# Altium project HVAMP_8CH.PrjPCB (part 1 of 3)
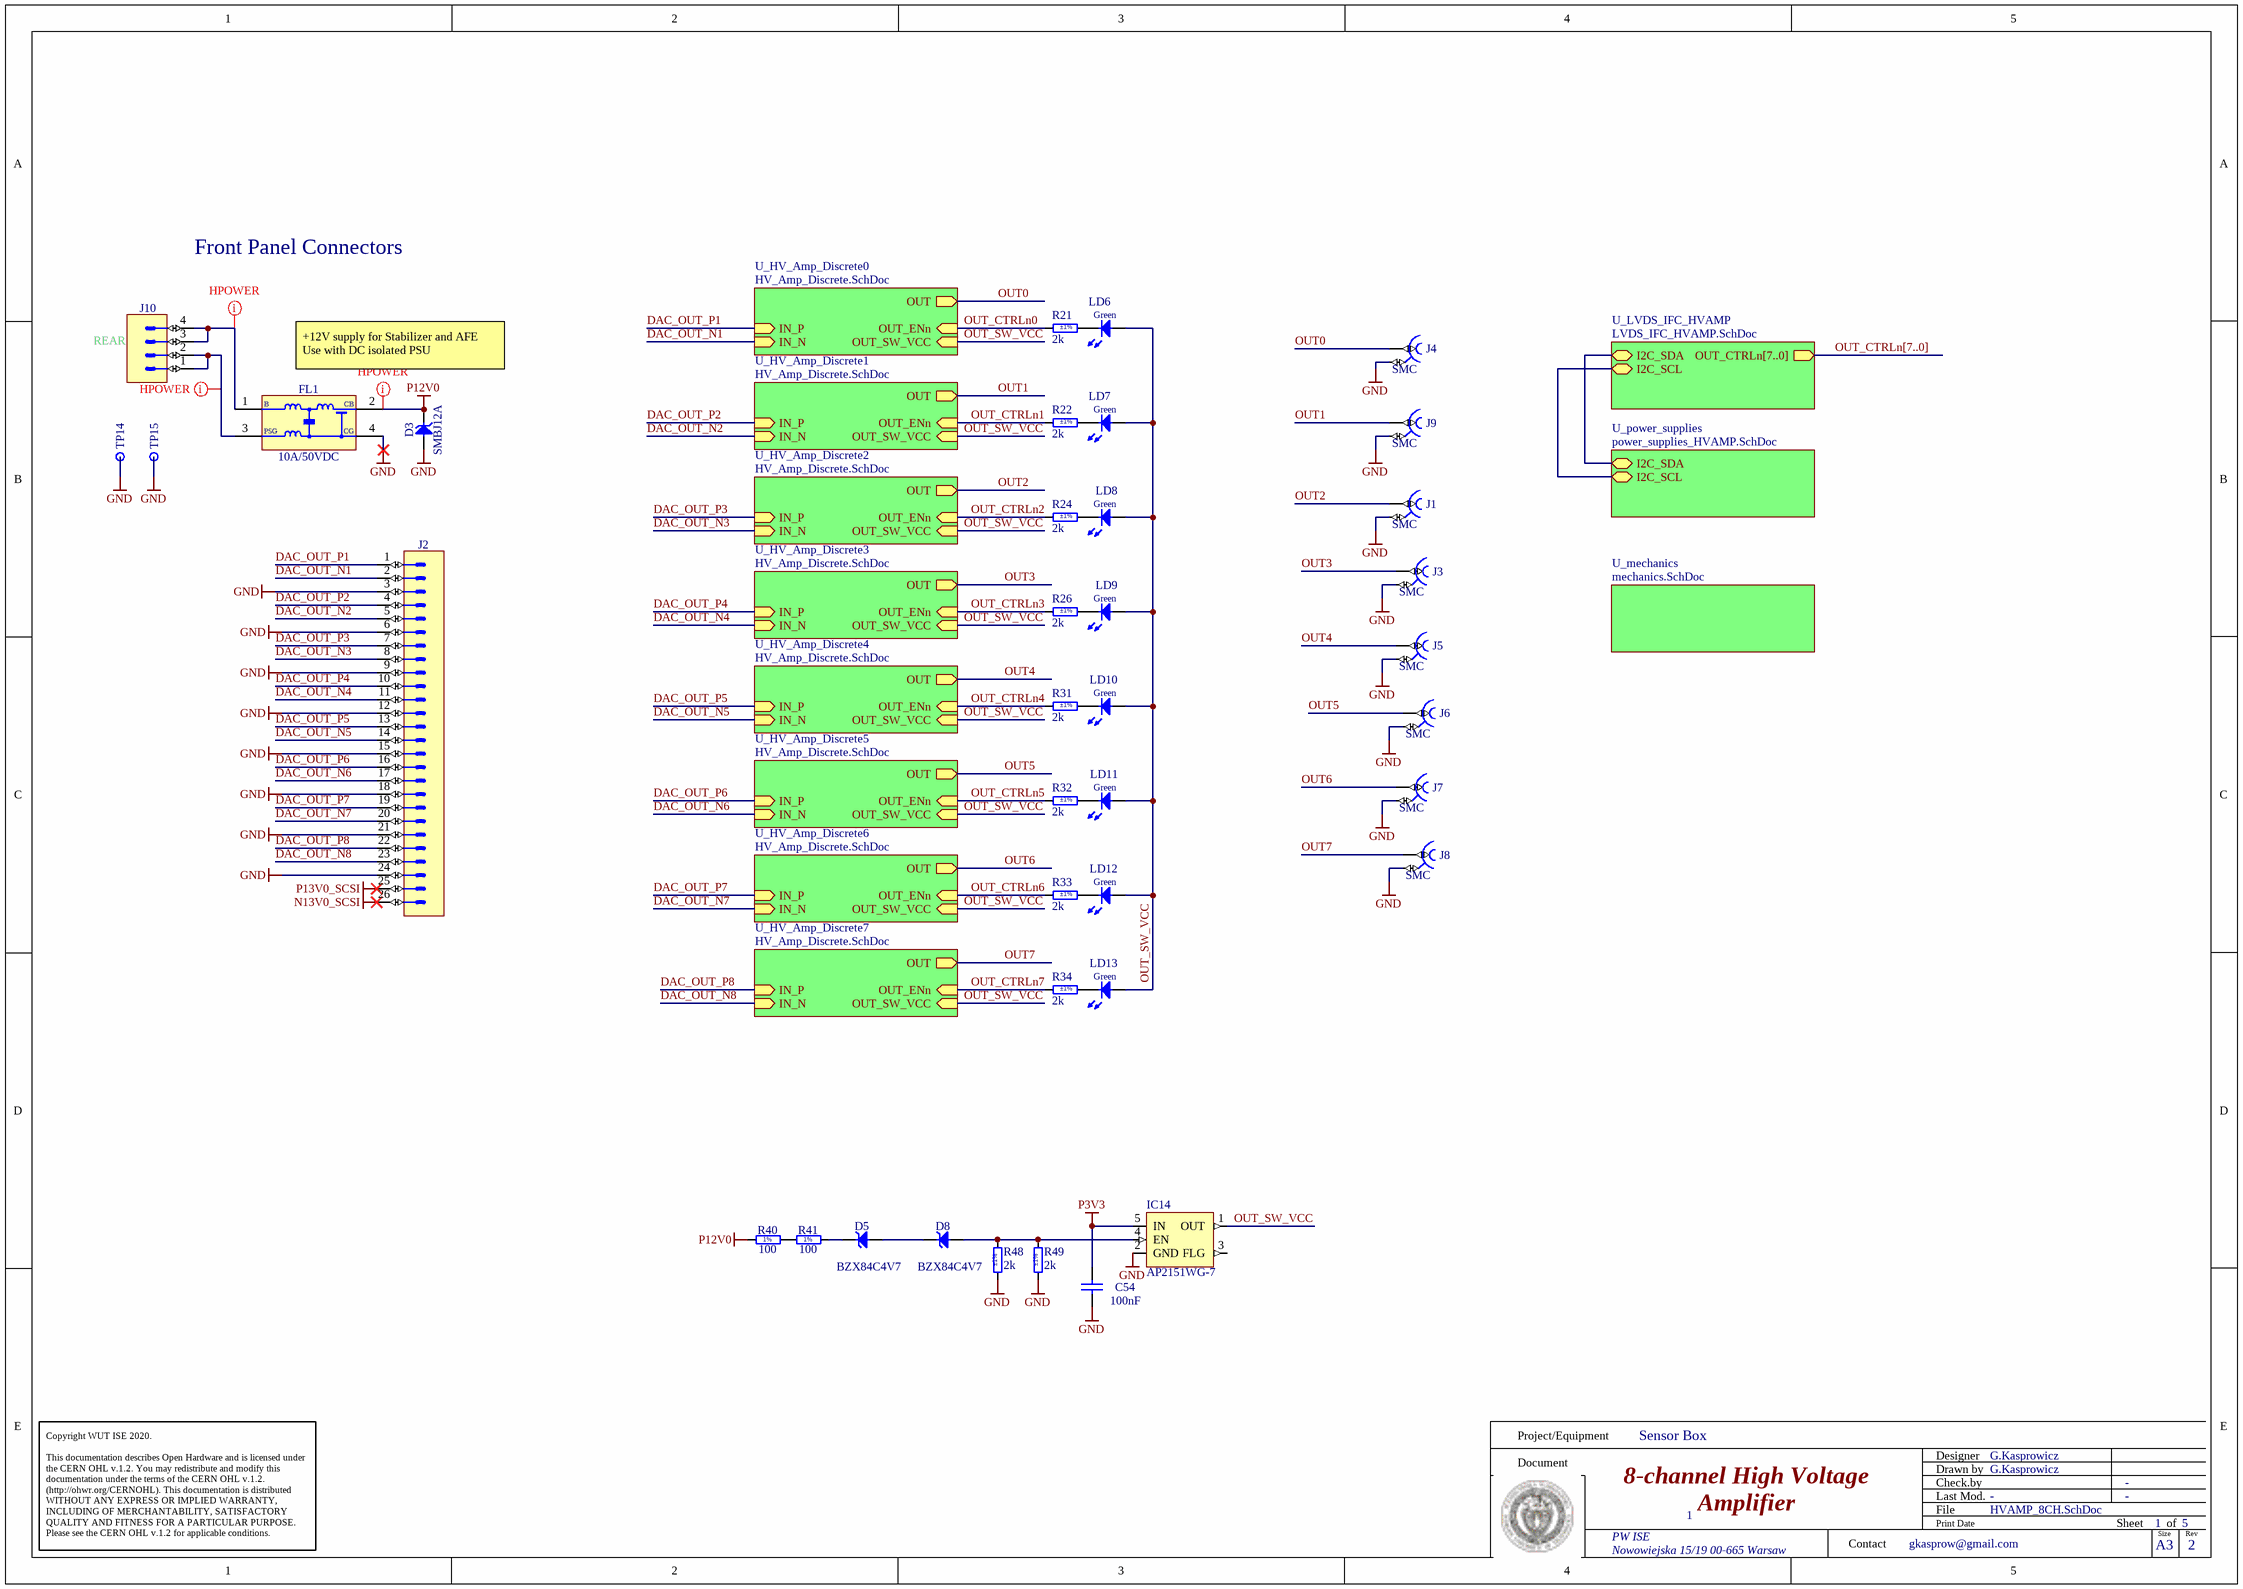
[diagram p0: HVAMP_8CH.SchDoc]
ProjRevision: 1.2; ProjOrganization: Institute of Electronic systems; ProjAddress3: Warsaw, Poland; ProjAddress2: Nowowiejska 15/19; ProjAddress1: Warsaw University of Technology
5 sheets, 364 parts. Net scope: hierarchical (ports join the sheet entries above them; power ports are global).
Board files: HVAMP_8CH.PcbDoc, Panel_HVAMP_8CH.PcbDoc
Sheets:
  HVAMP_8CH.SchDoc
    U_power_supplies = power_supplies_HVAMP.SchDoc
    U_mechanics = mechanics.SchDoc
    U_LVDS_IFC_HVAMP = LVDS_IFC_HVAMP.SchDoc
    U_HV_Amp_Discrete0 = HV_Amp_Discrete.SchDoc
    U_HV_Amp_Discrete1 = HV_Amp_Discrete.SchDoc
    U_HV_Amp_Discrete2 = HV_Amp_Discrete.SchDoc
    U_HV_Amp_Discrete3 = HV_Amp_Discrete.SchDoc
    U_HV_Amp_Discrete4 = HV_Amp_Discrete.SchDoc
    U_HV_Amp_Discrete5 = HV_Amp_Discrete.SchDoc
    U_HV_Amp_Discrete6 = HV_Amp_Discrete.SchDoc
    U_HV_Amp_Discrete7 = HV_Amp_Discrete.SchDoc

## Sheet HVAMP_8CH.SchDoc: 8-channel High Voltage
size 420 x 297 mm; Author: G.Kasprowicz; CompanyName: WUT ISE; DrawnBy: G.Kasprowicz; Organization: WUT ISE; Address1: PW ISE; Address2: Nowowiejska 15/19 00-665 Warsaw; Address3: gkasprow@gmail.com; DocumentNumber: 1; Revision: 2; SheetNumber: 1; SheetTotal: 5; ModifiedBy: -; CheckedDate: -; Title2: Amplifier; DivGrp: WUT ISE; Designer: G.Kasprowicz; ModifiedDate: -; ProjectName: Sensor Box

### Parts
C54  100nF  [CAPC1005X55N]
D3  SMBJ12A  [DIOM5336X265N]
D5  BZX84C4V7  [SOT95P240X130-3N]
D8  BZX84C4V7  [SOT95P240X130-3N]
FL1  10A/50VDC  [FIL_MURATA_BNX02]
IC14  AP2151WG-7  [SOT23-5]
J1  SMC  [JOHNSON_131-6701-341]
J2  Header 26  [3M_N2526-6002RB]  (value not drawn)
J3  SMC  [JOHNSON_131-6701-341]
J4  SMC  [JOHNSON_131-6701-341]
J5  SMC  [JOHNSON_131-6701-341]
J6  SMC  [JOHNSON_131-6701-341]
J7  SMC  [JOHNSON_131-6701-341]
J8  SMC  [JOHNSON_131-6701-341]
J9  SMC  [JOHNSON_131-6701-341]
J10  Mini-Fit Jr.™  [MOLEX_39-30-0040]  (value not drawn)
LD6  Green  [LED_AVAGO_HSME-C120]
LD7  Green  [LED_AVAGO_HSME-C120]
LD8  Green  [LED_AVAGO_HSME-C120]
LD9  Green  [LED_AVAGO_HSME-C120]
LD10  Green  [LED_AVAGO_HSME-C120]
LD11  Green  [LED_AVAGO_HSME-C120]
LD12  Green  [LED_AVAGO_HSME-C120]
LD13  Green  [LED_AVAGO_HSME-C120]
R21  2k  Tolerance: ±1%  [RESC1005X40N]
R22  2k  Tolerance: ±1%  [RESC1005X40N]
R24  2k  Tolerance: ±1%  [RESC1005X40N]
R26  2k  Tolerance: ±1%  [RESC1005X40N]
R31  2k  Tolerance: ±1%  [RESC1005X40N]
R32  2k  Tolerance: ±1%  [RESC1005X40N]
R33  2k  Tolerance: ±1%  [RESC1005X40N]
R34  2k  Tolerance: ±1%  [RESC1005X40N]
R40  100  [RESC1005X40N]
R41  100  [RESC1005X40N]
R48  2k  Tolerance: ±1%  [RESC1005X40N]
R49  2k  Tolerance: ±1%  [RESC1005X40N]
TP14  Test Point  [TPS127]  (value not drawn)
TP15  Test Point  [TPS127]  (value not drawn)

### Sub-sheets
U_HV_Amp_Discrete0 = HV_Amp_Discrete.SchDoc: OUT (out), IN_P (in), IN_N (in), OUT_ENn (in), OUT_SW_VCC (in)
U_HV_Amp_Discrete1 = HV_Amp_Discrete.SchDoc: OUT (out), IN_P (in), IN_N (in), OUT_ENn (in), OUT_SW_VCC (in)
U_HV_Amp_Discrete2 = HV_Amp_Discrete.SchDoc: OUT (out), IN_P (in), IN_N (in), OUT_ENn (in), OUT_SW_VCC (in)
U_HV_Amp_Discrete3 = HV_Amp_Discrete.SchDoc: OUT (out), IN_P (in), IN_N (in), OUT_ENn (in), OUT_SW_VCC (in)
U_HV_Amp_Discrete4 = HV_Amp_Discrete.SchDoc: OUT (out), IN_P (in), IN_N (in), OUT_ENn (in), OUT_SW_VCC (in)
U_HV_Amp_Discrete5 = HV_Amp_Discrete.SchDoc: OUT (out), IN_P (in), IN_N (in), OUT_ENn (in), OUT_SW_VCC (in)
U_HV_Amp_Discrete6 = HV_Amp_Discrete.SchDoc: OUT (out), IN_P (in), IN_N (in), OUT_ENn (in), OUT_SW_VCC (in)
U_HV_Amp_Discrete7 = HV_Amp_Discrete.SchDoc: OUT (out), IN_P (in), IN_N (in), OUT_ENn (in), OUT_SW_VCC (in)
U_LVDS_IFC_HVAMP = LVDS_IFC_HVAMP.SchDoc: I2C_SDA (bidir), I2C_SCL (bidir), OUT_CTRLn[7..0] (out)
U_mechanics = mechanics.SchDoc: no entries
U_power_supplies = power_supplies_HVAMP.SchDoc: I2C_SDA (bidir), I2C_SCL (bidir)

### Nets
GND: C54.1 D3.2(A) FL1.4(CG) IC14.2(GND) J1.2 J2.3 J2.6 J2.9 J2.12 J2.15 J2.18 J2.21 J2.24 J3.2 J4.2 J5.2 J6.2 J7.2 J8.2 J9.2 R48.2 R49.2 TP14.1 TP15.1
N13V0_SCSI: J2.26
P3V3: C54.2 IC14.5(IN)
P12V0: D3.1(C) FL1.2(CB) R40.1
P13V0_SCSI: J2.25
DAC_OUT_N1: J2.2 ; sheet U_HV_Amp_Discrete0/IN_N
DAC_OUT_N2: J2.5 ; sheet U_HV_Amp_Discrete1/IN_N
DAC_OUT_N3: J2.8 ; sheet U_HV_Amp_Discrete2/IN_N
DAC_OUT_N4: J2.11 ; sheet U_HV_Amp_Discrete3/IN_N
DAC_OUT_N5: J2.14 ; sheet U_HV_Amp_Discrete4/IN_N
DAC_OUT_N6: J2.17 ; sheet U_HV_Amp_Discrete5/IN_N
DAC_OUT_N7: J2.20 ; sheet U_HV_Amp_Discrete6/IN_N
DAC_OUT_N8: J2.23 ; sheet U_HV_Amp_Discrete7/IN_N
DAC_OUT_P1: J2.1 ; sheet U_HV_Amp_Discrete0/IN_P
DAC_OUT_P2: J2.4 ; sheet U_HV_Amp_Discrete1/IN_P
DAC_OUT_P3: J2.7 ; sheet U_HV_Amp_Discrete2/IN_P
DAC_OUT_P4: J2.10 ; sheet U_HV_Amp_Discrete3/IN_P
DAC_OUT_P5: J2.13 ; sheet U_HV_Amp_Discrete4/IN_P
DAC_OUT_P6: J2.16 ; sheet U_HV_Amp_Discrete5/IN_P
DAC_OUT_P7: J2.19 ; sheet U_HV_Amp_Discrete6/IN_P
DAC_OUT_P8: J2.22 ; sheet U_HV_Amp_Discrete7/IN_P
I2C_SCL: sheet U_power_supplies/I2C_SCL, sheet U_LVDS_IFC_HVAMP/I2C_SCL
I2C_SDA: sheet U_power_supplies/I2C_SDA, sheet U_LVDS_IFC_HVAMP/I2C_SDA
OUT0: J4.1 ; sheet U_HV_Amp_Discrete0/OUT
OUT1: J9.1 ; sheet U_HV_Amp_Discrete1/OUT
OUT2: J1.1 ; sheet U_HV_Amp_Discrete2/OUT
OUT3: J3.1 ; sheet U_HV_Amp_Discrete3/OUT
OUT4: J5.1 ; sheet U_HV_Amp_Discrete4/OUT
OUT5: J6.1 ; sheet U_HV_Amp_Discrete5/OUT
OUT6: J7.1 ; sheet U_HV_Amp_Discrete6/OUT
OUT7: J8.1 ; sheet U_HV_Amp_Discrete7/OUT
OUT_CTRLn0: R21.2 ; sheet U_HV_Amp_Discrete0/OUT_ENn
OUT_CTRLn1: R22.2 ; sheet U_HV_Amp_Discrete1/OUT_ENn
OUT_CTRLn2: R24.2 ; sheet U_HV_Amp_Discrete2/OUT_ENn
OUT_CTRLn3: R26.2 ; sheet U_HV_Amp_Discrete3/OUT_ENn
OUT_CTRLn4: R31.2 ; sheet U_HV_Amp_Discrete4/OUT_ENn
OUT_CTRLn5: R32.2 ; sheet U_HV_Amp_Discrete5/OUT_ENn
OUT_CTRLn6: R33.2 ; sheet U_HV_Amp_Discrete6/OUT_ENn
OUT_CTRLn7: R34.2 ; sheet U_HV_Amp_Discrete7/OUT_ENn
OUT_SW_VCC: IC14.1(OUT) LD6.2(A) LD7.2(A) LD8.2(A) LD9.2(A) LD10.2(A) LD11.2(A) LD12.2(A) LD13.2(A) ; sheet U_HV_Amp_Discrete0/OUT_SW_VCC, sheet U_HV_Amp_Discrete1/OUT_SW_VCC, sheet U_HV_Amp_Discrete2/OUT_SW_VCC, sheet U_HV_Amp_Discrete3/OUT_SW_VCC, sheet U_HV_Amp_Discrete4/OUT_SW_VCC, sheet U_HV_Amp_Discrete5/OUT_SW_VCC, sheet U_HV_Amp_Discrete6/OUT_SW_VCC, sheet U_HV_Amp_Discrete7/OUT_SW_VCC
NetD5_1: D5.1(A) D8.3(C)
NetD5_3: D5.3(C) R41.2
NetD8_1: D8.1(A) IC14.4(EN) R48.1 R49.1
NetFL1_1: FL1.1(B) J10.3 J10.4
NetFL1_3: FL1.3(PSG) J10.1 J10.2
NetLD6_1: LD6.1(C) R21.1
NetLD7_1: LD7.1(C) R22.1
NetLD8_1: LD8.1(C) R24.1
NetLD9_1: LD9.1(C) R26.1
NetLD10_1: LD10.1(C) R31.1
NetLD11_1: LD11.1(C) R32.1
NetLD12_1: LD12.1(C) R33.1
NetLD13_1: LD13.1(C) R34.1
NetR40_2: R40.2 R41.1

Not connected (* = marked no-connect by the designer): IC14 3(FLG)

### Buses and harness runs
bus OUT_CTRLn[7..0] = sheet U_LVDS_IFC_HVAMP/OUT_CTRLn[7..0]

### Layout directives
net class Hpower: NetFL1_1, NetFL1_3, P12V0

### Notes on the sheet
- Front Panel Connectors
- (near J10) REAR
- +12V supply for Stabilizer and AFE
  Use with DC isolated PSU
- Project/Equipment
- Document
- Designer
- Drawn by
- Check.by
- Copyright WUT ISE 2020.
  This documentation describes Open Hardware and is licensed under the CERN OHL v.1.2. You may redistribute and modify this documentation under the terms of the CERN OHL v.1.2. (http://ohwr.org/CERNOHL). This documentation is distributed WITHOUT ANY EXPRESS OR IMPLIED WARRANTY, INCLUDING OF MERCHANTABILITY, SATISFACTORY QUALITY AND FITNESS FOR A PARTICULAR PURPOSE. Please see the CERN OHL v.1.2 for applicable conditions.
- Contact
- File
- Last Mod.
- Print Date
- Sheet
- Size
- A3
- of
- Rev
- (in symbol R0402_100R_1%_0.0625W_100PPM) 1%

### Library data of the parts
C54 = CC0402_100NF_16V_10%_X5R: Non-polarised capacitor; Part Description: SMD Multilayer Chip Ceramic Capacitor; Manufacturer: GENERIC; Manufacturer1 Part Number: GRM155R61C104KA88D; Voltage: 16V; TC: X5R; Tolerance: ±10%; Part Number: CC0402_100NF_16V_10%_X5R; Component Kind: Standard; Component Type: Standard; Pin Count: 2; Value: 100nF; Status: None; Manufacturer Part Number: CC0402_100NF_16V_10%_X5R; Case: 0402; Mounted: Yes; Socket: No; SMD: Yes; Sense: No; Manufacturer1 Example: MURATA; Manufacturer1 ComponentHeight: 0.55mm; HelpURL: \\cern.ch\dfs\Applications\Altium\Datasheets\CC0402_X5R_MURATA_GRM.pdf; Author: CERN DEM JLC; CreateDate: 10.12.2013; LatestRevisionDate: 10.12.2013
D3 = SMBJ12A: Zener Diode; Part Description: Uni-Directional Transient Voltage Suppressor Diode; Manufacturer: FAIRCHILD SEMICONDUCTOR; Voltage: 12V; Power: 600W; PressFit: No; Bonding: No; Part Number: SMBJ12A; Component Kind: Standard; Component Type: Standard; Device: SMBJ12A; PackageDescription: DO-214-AA/SMB Diode, Molded Body; 5.34mm L X 3.625mm W X 2.65mm H, IPC Medium Density; Manufacturer Part Number: SMBJ12A; Pin Count: 2; Case: DO-214AA; Mounted: Yes; Socket: No; SMD: Yes; Sense: No; ComponentHeight: 2.65mm; HelpURL: \\cern.ch\dfs\Applications\Altium\Datasheets\SMBJ.pdf; Author: CERN DEM JLC; CreateDate: 10/04/2013; LatestRevisionDate: 10/04/2013
D5 D8 = BZX84C4V7: Diode Zener Anode Pin 1 Cathode Pin 3 (Pas de pin 2); Part Description: Zener Diode; Manufacturer: FAIRCHILD SEMICONDUCTOR; Voltage: 4V7; Power: 350mW; PressFit: No; Bonding: No; Part Number: BZX84C4V7; Component Kind: Standard; Component Type: Standard; Device: BZX84C4V7; PackageDescription: SOT, 0.95mm Pitch; 3 Pin, 1.30mm W X 2.90mm L X 1.30mm H body, IPC Medium Density; Manufacturer Part Number: BZX84C4V7; Pin Count: 3; Case: SOT23-3; Mounted: Yes; Socket: No; SMD: Yes; Sense: No; ComponentHeight: 1.3mm; HelpURL: \\cern.ch\dfs\Applications\Altium\Datasheets\BZX84C4V7.pdf; Author: CERN DEM JLC; CreateDate: 15.06.2011; LatestRevisionDate: 15.06.2011
FL1 = FIL_MURATA_BNX022-01L: Block Type EMIFIL (LC Combined); Part Description: Block Type EMIFIL (LC Combined) SMD Type, BNX02* Series; Manufacturer: MURATA; Resistance: 0.5R; Part Number: FIL_MURATA_BNX022-01L; Component Kind: Standard; Component Type: Standard; Pin Count: 2; Value: 10A/50VDC; Status: None; Manufacturer Part Number: BNX022-01L; Mounted: Yes; Socket: No; SMD: Yes; Sense: No; ComponentHeight: 3.3mm; HelpURL: \\cern.ch\dfs\Applications\Altium\Datasheets\FIL_MURATA_BNX022-01L.pdf; Author: CERN DEM JLC; CreateDate: 10/10/2012; LatestRevisionDate: 10/10/2012
IC14 = IFC_AP2151: 0.5A SINGLE CHANNEL CURRENT- LIMITED POWER Switch
J1 J3-J9 = JOHNSON_131-6701-341: Part Description: SMC 50 Ohms Right Angle Bulkhead Jack Receptacle; PressFit: No; Part Number: JOHNSON_131-6701-341; Component Kind: Standard; Component Type: Standard; Pin Count: 2; Family: SMC; Mounted: Yes; Socket: No; SMD: No; Sense: No; Status: None; Manufacturer: JOHNSON; Manufacturer Part Number: 131-6701-341; ComponentHeight: 7.67mm; HelpURL: \\cern.ch\dfs\Applications\Altium\Datasheets\JOHNSON_131-6701-341.pdf; Author: CERN DEM JLC; CreateDate: 16.02.2010; LatestRevisionDate: 12.01.2017
J2 = 3M_N2526-6002RB: Connector 26 Male; Part Description: 26 Contacts - Straight .100'' x .100'' Low Profile Four-Wall Header, 2500 Series; Manufacturer: 3M; PressFit: No; Part Number: 3M_N2526-6002RB; Component Kind: Standard; Component Type: Standard; Pin Count: 26; Family: Header 26; Mounted: Yes; Socket: No; SMD: No; Sense: No; Status: None; Manufacturer Part Number: N2526-6002RB; ComponentHeight: 10.03mm; HelpURL: \\cern.ch\dfs\Applications\Altium\Datasheets\3M_N2526-6002RB.pdf; Author: CERN DEM JLC; CreateDate: 11.02.2009; LatestRevisionDate: 11.08.2009
J10 = MOLEX_39-30-0040: Connector 4 Male; Part Description: 4.20mm (.165") Pitch Mini-Fit Jr. Header, Dual Row, Right Angle with Snap-in Plastic Peg PCB Lock, 4 Circuits; Manufacturer: MOLEX; PressFit: No; Part Number: MOLEX_39-30-0040; Component Kind: Standard; Component Type: Standard; Pin Count: 4; Family: Mini-Fit Jr.™; Mounted: Yes; Socket: No; SMD: No; Sense: No; Status: None; Manufacturer Part Number: 39-30-0040; ComponentHeight: 11.4mm; HelpURL: \\cern.ch\dfs\Applications\Altium\Datasheets\MOLEX_39-30-0040.pdf; Author: CERN DEM JLC; CreateDate: 02/10/2018; LatestRevisionDate: 02/10/2018
LD6-LD13 = LED_AVAGO_HSME-C120: LED Green 1C 2A; Part Description: High Performance Right Angle Chip Green LED; Manufacturer: AVAGO TECHNOLOGIES; PressFit: No; Bonding: No; Part Number: LED_AVAGO_HSME-C120; Component Kind: Standard; Component Type: Standard; Color: Green; PackageDescription: Green Chip LED, 2-Leads, Body 1.7x1.1mm, Side Emitting Package; Manufacturer Part Number: HSME-C120; Pin Count: 2; Mounted: Yes; Socket: No; SMD: Yes; Sense: No; ComponentHeight: 0.7mm; HelpURL: \\cern.ch\dfs\Applications\Altium\Datasheets\LED_AVAGO_HSME-C120.pdf; ComponentLink1URL: \\cern.ch\dfs\Applications\Altium\Datasheets\LED_AVAGO_HSME-C110_DESIGN-GUIDE.pdf; ComponentLink1Description: Design Guide; Author: CERN DEM JMW; CreateDate: 22.07.2009; LatestRevisionDate: 20.06.2012
R21 R22 R24 R26 R31-R34 R48 R49 = R0402_2K_1%_0.0625W_100PPM: Resistor - 1%; Part Description: General Purpose Thick Film Chip Resistor; Manufacturer: GENERIC; Manufacturer1 Part Number: 232270672002L; TC: ±100ppm/°C; PressFit: No; Part Number: R0402_2K_1%_0.0625W_100PPM; Component Kind: Standard; Component Type: Standard; Pin Count: 2; Value: 2k; Status: Not Recommended; Power: 0.0625W; Manufacturer Part Number: R0402_2K_1%_0.0625W_100PPM; Case: 0402; Mounted: Yes; Sense: No; Socket: No; SMD: Yes; Manufacturer1 Example: YAGEO PHYCOMP; Manufacturer1 ComponentHeight: 0.4mm; HelpURL: \\cern.ch\dfs\Applications\Altium\Datasheets\R0402_Phycomp_RC0402.pdf; Author: CERN DEM JLC; CreateDate: 03.12.2007; LatestRevisionDate: 17.10.2012
R40 R41 = R0402_100R_1%_0.0625W_100PPM: Resistor - 1%; Part Description: General Purpose Thick Film Chip Resistor; Manufacturer: GENERIC; Manufacturer1 Part Number: 232270671001L; TC: ±100ppm/°C; PressFit: No; Part Number: R0402_100R_1%_0.0625W_100PPM; Component Kind: Standard; Component Type: Standard; Pin Count: 2; Value: 100; Status: Not Recommended; Power: 0.0625W; Tolerance: ±1%; Manufacturer Part Number: R0402_100R_1%_0.0625W_100PPM; Case: 0402; Mounted: Yes; Sense: No; Socket: No; SMD: Yes; Manufacturer1 Example: YAGEO PHYCOMP; Manufacturer1 ComponentHeight: 0.4mm; HelpURL: \\cern.ch\dfs\Applications\Altium\Datasheets\R0402_Phycomp_RC0402.pdf; Author: CERN DEM JLC; CreateDate: 03.12.2007; LatestRevisionDate: 17.10.2012
TP14 TP15 = SMD_PAD_1.27X1.27MM: Part Description: 1.27mm x 1.27mm PCB Copper Area (SMD Test Point); Mounted: No; Part Number: SMD_PAD_1.27X1.27MM; Component Kind: Standard (No BOM); Component Type: Standard (No BOM); Pin Count: 1; Family: Test Point; Socket: No; SMD: Yes; Sense: No; Status: None; ComponentHeight: 0mm; HelpURL: Undefined; Author: CERN DEM JLC; CreateDate: 12/01/2008; LatestRevisionDate: 12/01/2008; PackageDescription: 1.27mm x 1.27mm PCB Copper Area (SMD Test Point)